# Altium schematic sheet MCU.SchDoc
size A4
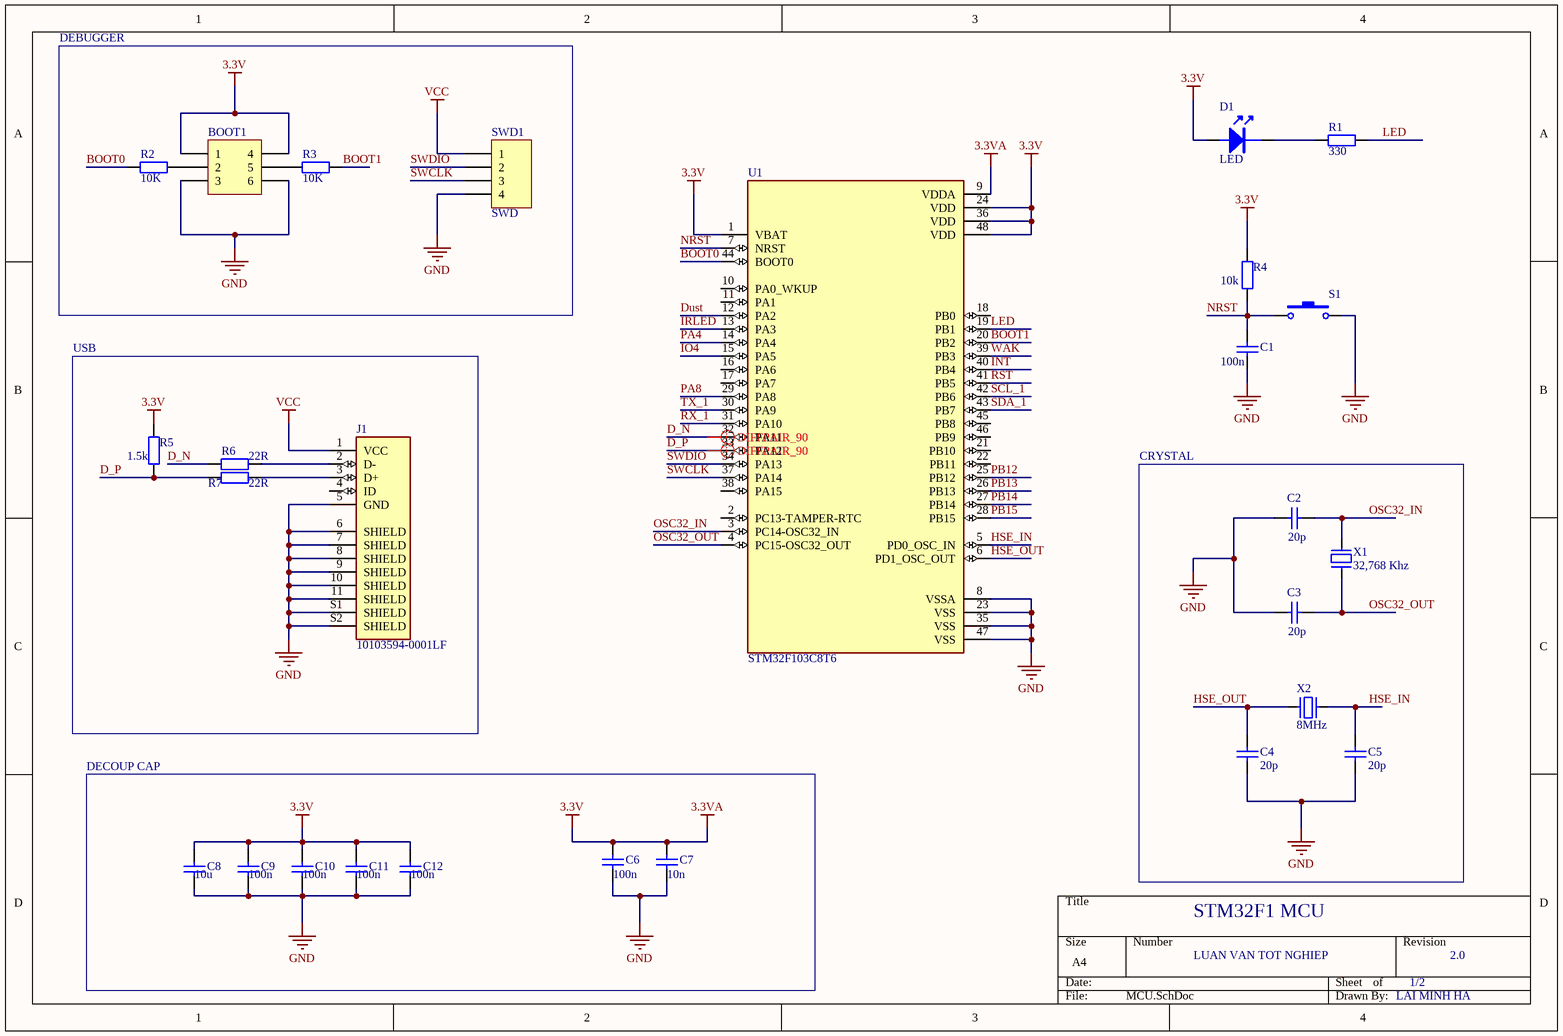
[diagram p0: MCU.SchDoc]

## Parts
BOOT1  Header 3X2A  [HDR2X3_CEN]  (value not drawn)
C1  100n  [C0805]
C2  20p  [C0805]
C3  20p  [C0805]
C4  20p  [C0805]
C5  20p  [C0805]
C6  100n  [C0805]
C7  10n  [C0805]
C8  10u  [C0805]
C9  100n  [C0805]
C10  100n  [C0805]
C11  100n  [C0805]
C12  100n  [C0805]
D1  LED  [LED 0805]
J1  10103594-0001LF  [AMPHENOL_10103594-0001LF]
R1  value 330  [DIEN TRO 0805]  (hidden comment: R0805)
R2  value 10K  [DIEN TRO 0805]  (hidden comment: R0805)
R3  value 10K  [DIEN TRO 0805]  (hidden comment: R0805)
R4  10k  [DIEN TRO 0805]
R5  1.5k  [DIEN TRO 0805]
R6  22R  [DIEN TRO 0805]
R7  22R  [DIEN TRO 0805]
S1  SW-SMD  [SW-SMD]  (value not drawn)
SWD1  SWD  [HDR1X4]
U1  STM32F103C8T6  [QFP50P900X900X160-48N]
X1  32,768 Khz  [XT32k]
X2  8MHz  [XT2]

## Nets
3.3V: BOOT1.1 BOOT1.4 C6.2 C7.2 C8.2 C9.2 C10.2 C11.2 C12.2 D1.1 R4.1 R5.1 U1.1(VBAT) U1.9(VDDA) U1.24(VDD) U1.36(VDD) U1.48(VDD)  [also labelled 3.3VA]
GND: BOOT1.3 BOOT1.6 C1.1 C2.1 C3.1 C4.1 C5.1 C6.1 C7.1 C8.1 C9.1 C10.1 C11.1 C12.1 J1.5(GND) J1.6(SHIELD) J1.7(SHIELD) J1.8(SHIELD) J1.9(SHIELD) J1.10(SHIELD) J1.11(SHIELD) J1.S1(SHIELD) J1.S2(SHIELD) S1.2 SWD1.4 U1.8(VSSA) U1.23(VSS) U1.35(VSS) U1.47(VSS)
VCC: J1.1(VCC) SWD1.1
BOOT0: R2.1 U1.44(BOOT0)
BOOT1: R3.2 U1.20(PB2)
D_N: R6.1 U1.32(PA11)
D_P: R5.2 R7.1 U1.33(PA12)
Dust: U1.12(PA2)
HSE_IN: C5.2 U1.5(PD0_OSC_IN) X2.2
HSE_OUT: C4.2 U1.6(PD1_OSC_OUT) X2.1
INT: U1.40(PB4)
IO4: U1.15(PA5)
IRLED: U1.13(PA3)
LED: R1.2 U1.19(PB1)
NRST: C1.2 R4.2 S1.1 U1.7(NRST)
OSC32_IN: C2.2 U1.3(PC14-OSC32_IN) X1.1
OSC32_OUT: C3.2 U1.4(PC15-OSC32_OUT) X1.2
PA4: U1.14(PA4)
PA8: U1.29(PA8)
PB12: U1.25(PB12)
PB13: U1.26(PB13)
PB14: U1.27(PB14)
PB15: U1.28(PB15)
RST: U1.41(PB5)
RX_1: U1.31(PA10)
SCL_1: U1.42(PB6)
SDA_1: U1.43(PB7)
SWCLK: SWD1.3 U1.37(PA14)
SWDIO: SWD1.2 U1.34(PA13)
TX_1: U1.30(PA9)
WAK: U1.39(PB3)
NetBOOT1_2: BOOT1.2 R2.2
NetBOOT1_5: BOOT1.5 R3.1
NetD1_2: D1.2 R1.1
NetJ1_2: J1.2(D-) R6.2
NetJ1_3: J1.3(D+) R7.2

Not connected (* = marked no-connect by the designer): J1 4(ID); U1 2(PC13-TAMPER-RTC) 10(PA0_WKUP) 11(PA1) 16(PA6) 17(PA7) 18(PB0) 21(PB10) 22(PB11) 38(PA15) 45(PB8) 46(PB9)

## Layout directives
differential pair; differential pair class diff_class: D_N, D_P

## Notes on the sheet
- DEBUGGER
- USB
- CRYSTAL
- DECOUP CAP
- STM32F1 MCU
- LUAN VAN TOT NGHIEP
- 1/2
- 2.0
- LAI MINH HA

## Library data of the parts
BOOT1 = Header 3X2A: Header, 3-Pin, Dual row; LatestRevisionDate: 17-Jul-2002; LatestRevisionNote: Re-released for DXP Platform.; Publisher: Altium Limited
C1-C12 = CapSMD: Capacitor; Value: 33p; Published: 8-Jun-2000; LatestRevisionDate: 17-Jul-2002; LatestRevisionNote: Re-released for DXP Platform.; PackageReference: RAD-0.3; Publisher: Altium Limited
J1 = 10103594-0001LF: USB - micro B USB 2.0 Receptacle Connector 5 Position Surface Mount, Right Angle; Through Hole; MF: Amphenol ICC (FCI); Package: None; MP: 10103594-0001LF; Check_prices: https://www.snapeda.com/parts/10103594-0001LF/Amphenol%20FCI/view-part/5161044/?ref=eda; Purchase-URL: https://pricing.snapeda.com/search/part/10103594-0001LF/?ref=eda; Value: *; Availability: Good; Price: None; SnapEDA_Link: https://www.snapeda.com/parts/10103594-0001LF/Amphenol%20FCI/view-part/5161044/?ref=snap
R1-R3 = R0805: Resistor SMD 0805; Published: 8-Jun-2000; LatestRevisionDate: 17-Jul-2002; LatestRevisionNote: Re-released for DXP Platform.; PackageReference: AXIAL-0.4; Publisher: Altium Limited
R4-R7 = R0805: Resistor SMD 0805; Value: 0805; Published: 8-Jun-2000; LatestRevisionDate: 17-Jul-2002; LatestRevisionNote: Re-released for DXP Platform.; PackageReference: AXIAL-0.4; Publisher: Altium Limited
S1 = SW-SMD: Switch; Published: 24-Mar-1999; LatestRevisionDate: 17-Jul-2002; LatestRevisionNote: Re-released for DXP Platform.; PackageReference: SPST-2; Publisher: Altium Limited
SWD1 = Header 4: Header, 4-Pin; LatestRevisionDate: 17-Jul-2002; LatestRevisionNote: Re-released for DXP Platform.; Publisher: Altium Limited
U1 = STM32F103C8T6: ARMÂ® CortexÂ®-M3 STM32F1 Microcontroller IC 32-Bit 72MHz 64KB _64K x 8_ FLASH; MF: STMicroelectronics; Price: None; Package: LQFP-48 STMicroelectronics; Value: *; MP: STM32F103C8T6; Availability: Unavailable; SnapEDA_Link: https://www.snapeda.com/parts/STM32F103C8T6/STMicroelectronics/view-part/52195/?ref=snap
X1 = XT32k: Crystal 32,768kHz for timer real; Value: 32,768khz
X2 = XT2: Crystal For all Crystal 2pin.; Value: 4Mhz